# EAGLE design M_G_ext_motor (EAGLE 9.6.2)
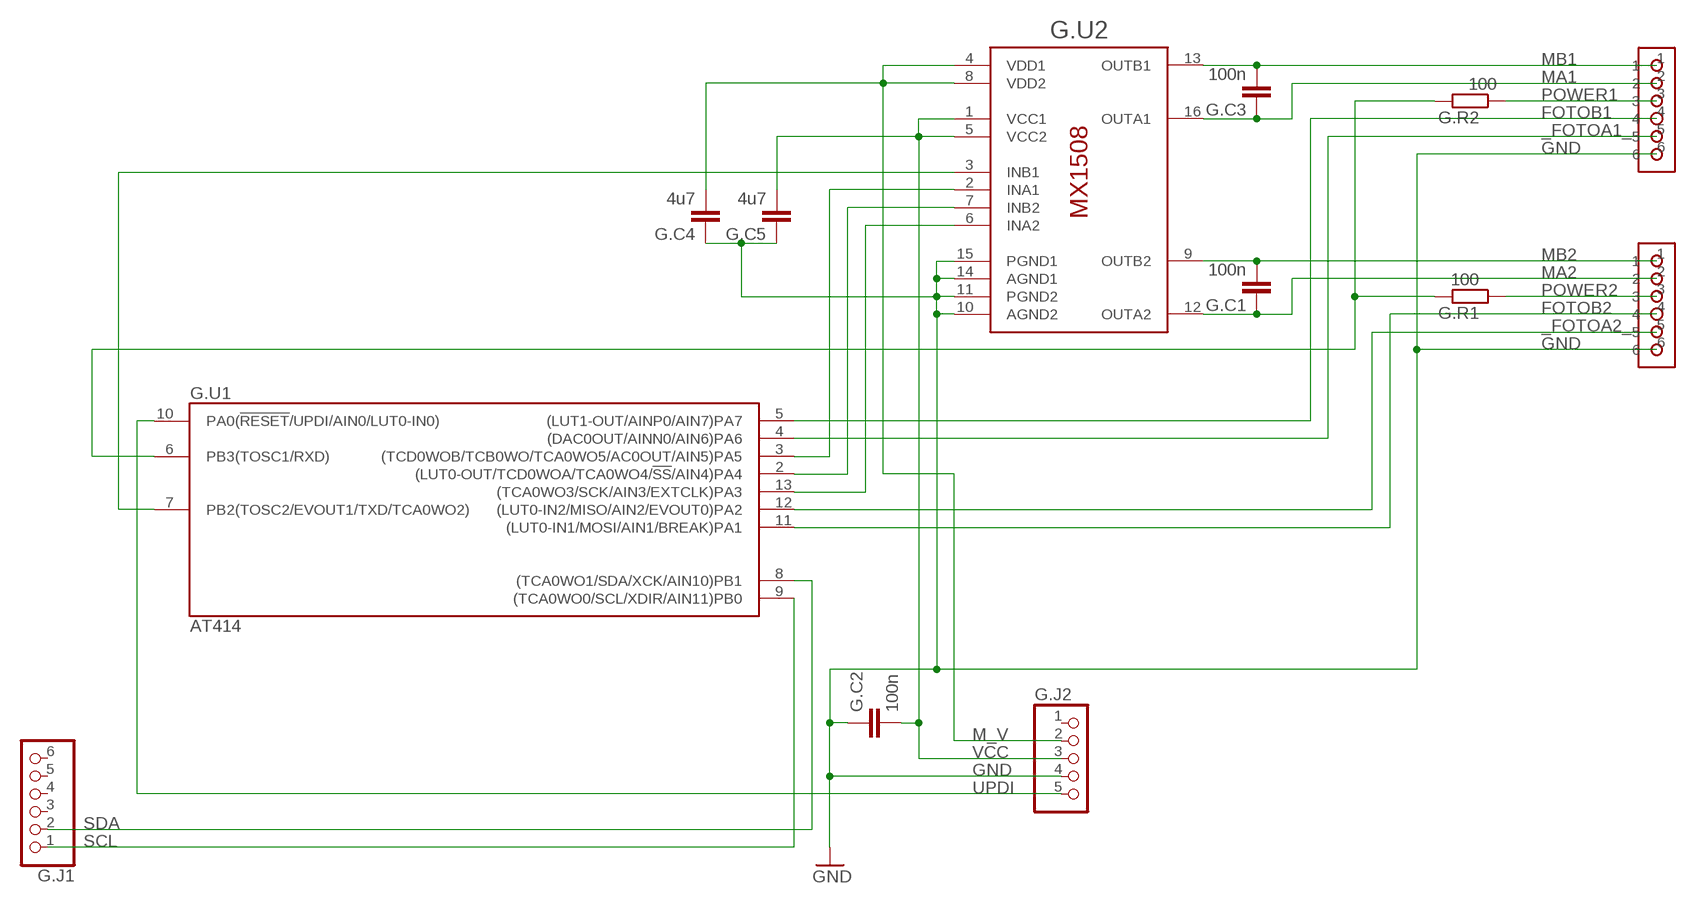
[diagram p0: schematic, sheet 1]

## Parts
G.C1  100n  C-EUC0603  [C0603]
G.C2  100n  C-EUC0603  [C0603]
G.C3  100n  C-EUC0603  [C0603]
G.C4  4u7  C-EUC0603  [C0603]
G.C5  4u7  C-EUC0603  [C0603]
G.J1  PINHD-1X6  [1X06]
G.J2  PINHD-1X5  [1X05]
G.J3  A1250WR-6  [A1250WR-6]
G.MOTO1  A1250WR-6  [A1250WR-6]
G.R1  100  R-EU_R0603  [R0603]
G.R2  100  R-EU_R0603  [R0603]
G.U1  AT414  ATTINY414-SSN  [SO14]
G.U2  MX1508  [SOP16]

## Nets
_FOTOA1_: G.MOTO1.5 G.U1.4((DAC0OUT/AINN0/AIN6)PA6)
_FOTOA2_: G.J3.5 G.U1.12((LUT0-IN2/MISO/AIN2/EVOUT0)PA2)
FOTOB1: G.MOTO1.4 G.U1.5((LUT1-OUT/AINP0/AIN7)PA7)
FOTOB2: G.J3.4 G.U1.11((LUT0-IN1/MOSI/AIN1/BREAK)PA1)
GND: G.C2.1 G.C4.1 G.C5.1 G.J2.4 G.J3.6 G.MOTO1.6 G.U2.10(AGND2) G.U2.11(PGND2) G.U2.14(AGND1) G.U2.15(PGND1)
INA1: G.U1.3((TCD0WOB/TCB0WO/TCA0WO5/AC0OUT/AIN5)PA5) G.U2.2(INA1)
INA2: G.U1.13((TCA0WO3/SCK/AIN3/EXTCLK)PA3) G.U2.6(INA2)
INB1: G.U1.7(PB2(TOSC2/EVOUT1/TXD/TCA0WO2)) G.U2.3(INB1)
INB2: G.U1.2((LUT0-OUT/TCD0WOA/TCA0WO4/!SS!/AIN4)PA4) G.U2.7(INB2)
M_V: G.C4.2 G.J2.2 G.U2.4(VDD1) G.U2.8(VDD2)
MA1: G.C3.1 G.MOTO1.2 G.U2.16(OUTA1)
MA2: G.C1.1 G.J3.2 G.U2.12(OUTA2)
MB1: G.C3.2 G.MOTO1.1 G.U2.13(OUTB1)
MB2: G.C1.2 G.J3.1 G.U2.9(OUTB2)
POWER1: G.MOTO1.3 G.R2.1
POWER2: G.J3.3 G.R1.1
POWER_LED: G.R1.2 G.R2.2 G.U1.6(PB3(TOSC1/RXD))
SCL: G.J1.1 G.U1.9((TCA0WO0/SCL/XDIR/AIN11)PB0)
SDA: G.J1.2 G.U1.8((TCA0WO1/SDA/XCK/AIN10)PB1)
UPDI: G.J2.5 G.U1.10(PA0(!RESET!/UPDI/AIN0/LUT0-IN0))
VCC: G.C2.2 G.C5.2 G.J2.3 G.U2.1(VCC1) G.U2.5(VCC2)
Unconnected: G.J1.3 G.J1.4 G.J1.5 G.J1.6 G.J2.1

## Power pins joined to a net without a drawn wire
GND: G.J3.$1(GND) G.J3.$2(GND) G.MOTO1.$1(GND) G.MOTO1.$2(GND) G.U1.14(GND)
VCC: G.U1.1(VCC)

## Library data of the parts
G.C1-G.C5 = rcl:C-EU: CAPACITOR, European symbol; SPICEPREFIX: C
G.J1 = pinhead2:PINHD-1X6: PIN HEADER
G.J2 = pinhead2:PINHD-1X5: PIN HEADER
G.J3 G.MOTO1 = hugo:A1250WR-6
G.R1 G.R2 = rcl:R-EU_: RESISTOR, European symbol; SPICEPREFIX: R
G.U1 = atmel:ATTINY*14: 8-bit AVR tiny-1-series Microcontroller CPU: two-cycle hardware multiplier single pin Unified Program Debug Interface (UPDI) programmable watchdog timer with separate on-chip oscillator programmable brown-out detection circuit with software disable function internal calibrated oscillator Status aktiv aktiv aktiv aktiv ATtiny214 ATtiny414 ATtiny814 ATtiny1614 General purpose working registers 32 SRAM 128 B 256 B 512 B 2 kB Program flash memory 2 kB 4 kB 8 kB 16 kB EEPROM 64 B 128 B 128 B 256 B 16-bit Timer/Counter type A (TCA) 1 16-bit Timer/Counter type B (TCB) 1 2 12-bit Timer/Counter type D (TCD) 1 Real Time Counter (RTC) 1 USART 1 SPI 1 TWI (I2C) 1 ADC 1 2 ADC channels 10 10+4 ADC resolution 10 bit DAC 1 3 AC 1 3 Peripheral Touch Controller (PTC) - 1 PTC number of self-capacitance channels - 6 PTC number of mutual-capacitance channels - 9 Custom Configurable Logic/Lookup tables 1/2 Window Watchdog 1 Event System channels 6 General purpose I/O 12 External interrupts 12 CRCSCAN 1 Operating voltage 1.8 ... 5.5 V Speed grade 0 ... 5 MHz @ 1.8 ... 5.5 V 0 ... 10 MHz @ 2.7 ... 5.5 V 0 ... 20 MHz @ 4.5 ... 5.5 V Clock options internal 16/20 MHz low power RC oscillator internal 32.768 kHz ultra low power RC oscillator external 32.768 kHz low-frequency crystal oscillator external clock input Pin Name Other/Special ADC0 ADC1 PTC AC0 AC1 AC2 DAC0 USART0 SPI0 TWI0 TCA0 TCBn TCD0 CCL PA0 !RESET, UPDI AIN0 LUT0-IN0 PA1 AIN1 TxD MOSI SDA LUT0-IN1 PA2 EVOUT0 AIN2 RxD MISO SCL LUT0-IN2 PA3 EXTCLK AIN3 XCK SCK WO3 TCB1 WO PA4 AIN4 AIN0 X0/Y0 XDIR !SS WO4 WOA LUT0-OUT PA5 VREFA AIN5 AIN1 X1/Y1 OUT AINN0 WO5 TCB0 WO WOB PA6 AIN6 AIN2 X2/Y2 AINN0 AINP1 AINP0 OUT PA7 AIN7 AIN3 X3/Y3 AINP0 AINP0 AINN0 LUT1-OUT PB3 TOSC1 OUT RxD WO0 PB2 TOSC2, EVOUT1 OUT TxD WO2 PB1 AIN10 X4/Y4 AINP2 XCK SDA WO1 PB0 AIN11 X5/Y5 AINP2 AINP1 XDIR SCL WO0 only available in devices with 8/16KByte flash, X- or Y-line only available in device ATtiny1614
G.U2 = hugo:MX1508

## Board
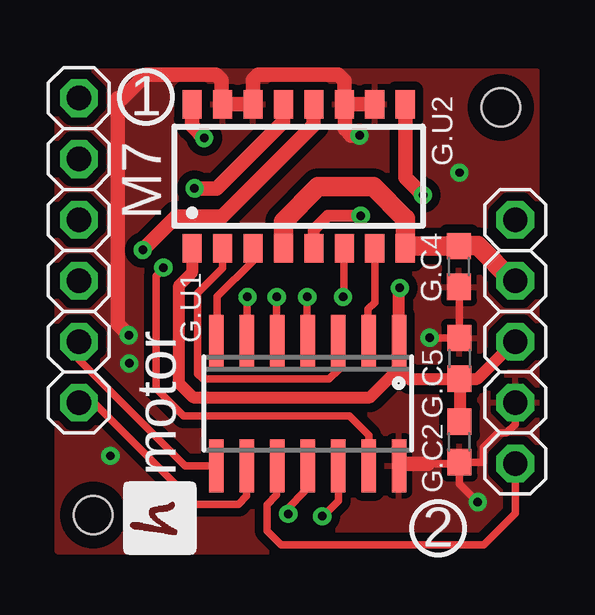
[diagram p1: board, top side]
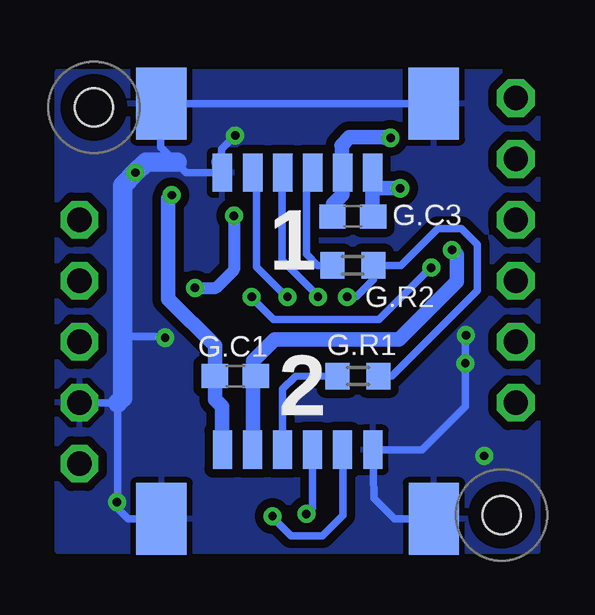
[diagram p2: board, bottom side, seen from below]

No outline drawn. Coordinates in mm, seen from the top.
Copper layers (1*16): Top 0.035mm / dielectric 1.5mm / Bottom 0.035mm
Design rules "default *": minimum track width 12mil, minimum drill 0.35mm, track to track 14mil, track to pad 13mil, pad to pad 10mil, via to via 14mil, smd to smd 14mil, copper to edge 15mil, drill to drill 15mil, minimum pad ring 10mil, minimum via ring 8mil, stop-mask expansion 4mil, vias tented up to drill 0mil, thermal gap 10mil
Holes 1.6 mm at 2,2 19,19
tRestrict: area 18,18 to 20,20; area 1,1 to 3,3
bRestrict: area 1,1 to 3,3; area 18,18 to 20,20

### Footprints (pad centres in the part's own frame; a part is rotated, then mirrored left to right if it is on the bottom)
C0603 = smd 1.1 x 1: 1 -0.85,0; 2 0.85,0
1X06 = drill 1.016 pad 1.575 octagon: 1 -6.35,0; 2 -3.81,0; 3 -1.27,0; 4 1.27,0; 5 3.81,0; 6 6.35,0
1X05 = drill 1.016 pad 1.575 octagon: 1 -5.08,0; 2 -2.54,0; 3 0,0; 4 2.54,0; 5 5.08,0
A1250WR-6 = smd 0.8 x 1.6: 1 -3.128,2.54; 2 -1.878,2.54; 3 -0.628,2.54; 4 0.622,2.54; 5 1.872,2.54; 6 3.142,2.54 | smd 2.1 x 3: $1 -5.678,-0.34; $2 5.682,-0.34
R0603 = smd 1 x 1.1: 1 -0.85,0; 2 0.85,0
SO14 = smd 0.6 x 2.2: 1 -3.81,-2.6; 2 -2.54,-2.6; 3 -1.27,-2.6; 4 0,-2.6; 5 1.27,-2.6; 6 2.54,-2.6; 7 3.81,-2.6; 8 3.81,2.6; 9 2.54,2.6; 10 1.27,2.6; 11 0,2.6; 12 -1.27,2.6; 13 -2.54,2.6; 14 -3.81,2.6
SOP16 = smd 0.8 x 1.2: 1 -4.445,-3; 2 -3.175,-3; 3 -1.905,-3; 4 -0.635,-3; 5 0.635,-3; 6 1.905,-3; 7 3.175,-3; 8 4.445,-3; 9 4.445,3; 10 3.175,3; 11 1.905,3; 12 0.635,3; 13 -0.635,3; 14 -1.905,3; 15 -3.175,3; 16 -4.445,3

### Placement (x,y rotation side)
G.C1  13.1,7.8 180 bottom
G.C2  17.27,5.05 90 top
G.C3  8.2,14.45 0 bottom
G.C4  17.25,12.37 90 top
G.C5  17.27,8.54 270 top
G.J1  1.4,13.04 90 top
G.J2  19.6,9.23 270 top
G.J3  10.5,2.18 0 bottom
G.MOTO1  10.5,18.82 180 bottom
G.R1  7.99,7.8 0 bottom
G.R2  8.2,12.42 0 bottom
G.U1  10.95,6.65 180 top
G.U2  10.57,16.13 0 top

### Tracks (layer width: path | path; a pad name or v marks a point on that pad's centre or on a via)
_FOTOA1_  (via drill 0.35)
  Top 0.305: G.U1.4 10.92,9.28 10.92,11.05 10.96,11.08 v10.92,11.1
  Bottom 0.305: v10.92,11.1 10.97,11.1 12.22,12.35 12.22,16.1 12.37,16.25 G.MOTO1.5
_FOTOA2_  (via drill 0.35)
  Top 0.305: G.U1.12 12.22,2.6 11.57,1.96 v11.55,1.96 11.51,1.92
  Bottom 0.305: G.J3.5 8.61,4.71 8.61,1.98 9.46,1.14 10.78,1.14 11.55,1.9 v11.55,1.96
FOTOB1  (via drill 0.35)
  Top 0.305: G.U1.5 9.65,9.28 v9.65,11.1
  Bottom 0.305: G.MOTO1.4 11.15,16.25 11.15,12.64 9.65,11.14 v9.65,11.1
FOTOB2  (via drill 0.35)
  Top 0.305: G.U1.11 10.82,3.93 10.82,2.99 10.13,2.3 v10.13,2.05
  Bottom 0.305: G.J3.4 9.88,2.3 v10.13,2.05
GND  (via drill 0.35)
  Top 0.305: G.C4.1 17.27,11.51 G.C5.1 16.04,9.39 v16.03,9.4 | 15.96,4.13 17.2,4.13 G.C2.1 | G.C2.1 17.27,3.3 v18.03,2.54 | 19.6,6.3 G.J2.4 19.6,5.79 19.23,5.42 18.87,5.42 18.28,4.83 18.28,4.21 G.C2.1
  Top 0.406: G.C2.1 17.27,3.92 17.18,3.83
  Top 0.61: G.C2.1 17.19,4.21 | 15.96,4.13 14.76,4.13 G.U1.14 | G.U2.11 G.U2.10 | G.U2.11 12.47,20.12 12.22,20.37 8.87,20.37 8.66,20.17 G.U2.14 G.U2.15 7.36,19.16 7.36,20.13 7.13,20.36 4.2,20.36 3.22,19.38 3.02,19.38 3.02,9.96 v3.48,9.5 | G.U2.11 12.5,19.1 12.5,18.09 12.75,17.83 v13.11,17.83
  Bottom 0.305: 15.51,1.84 17.58,1.84 18.03,2.3 v18.03,2.54 18.01,2.56 18.01,6.68 G.J2.4 | 15.58,16.71 15.58,16.79 15.52,16.73 | 15.58,16.71 16.21,17.35 16.21,19.16 5.49,19.16 | v3.48,9.5 3.5,9.48 v3.5,8.33 3.5,6.53 5.32,4.72 G.J3.6 7.33,2.71 6.46,1.84 4.79,1.84 | v13.11,17.83 13.68,17.26 G.MOTO1.6 15.15,16.28 15.58,16.71 | v16.03,9.4 16.08,9.45 17.8,9.45
  Bottom 0.61: v3.48,9.5 v3.49,9.5
  Bottom 0.813: 15.52,16.73 16.83,16.73 v17.27,16.28 17.8,15.75 17.8,9.45 17.8,6.88 18.01,6.68 | 13.7,16.71 13.68,16.69 G.MOTO1.6
  other vias: 2.72,4.47
  pour Top (isolate 0.254): 0.5,20.5 0.5,0.5 20.5,0.5 20.5,20.5
  pour Bottom (isolate 0.254): 0.5,20.5 0.5,0.5 20.5,0.5 20.5,20.5
INA1
  Top 0.305: G.U1.3 12.22,8.05 11.84,7.67 6.58,7.67 6.36,7.89 6.36,11.25 7.4,12.3 G.U2.2
INA2  (via drill 0.35)
  Top 0.305: G.U1.13 13.51,4.08 13.51,5.31 12.68,6.15 5.77,6.15 4.63,7.29 4.63,11.98 v4.93,12.32 | G.U2.6 12.45,13.1 12.45,11.2 v12.42,11.1
  Bottom 0.305: v12.42,11.1 12.42,11.08 11.5,10.16 7.1,10.16 v4.94,12.33 v4.93,12.32
INB1
  Top 0.305: G.U2.3 8.65,12.6 7.16,11.11 7.16,9.28 G.U1.7
INB2
  Top 0.305: 13.95,12.93 G.U2.7 13.74,10.87 13.46,10.59 13.46,9.28 G.U1.2
M_V
  Top 0.305: 15.01,14.37
  Top 0.813: G.U2.8 15.01,13.28 15.07,13.22 G.C4.2 17.27,13.24 18.03,13.24 19.5,11.77 G.J2.2 | 15.01,14.37 13.68,15.7 11.38,15.7 9.93,14.25 G.U2.4 | G.U2.8 15.01,13.23 | 15.01,14.37 G.U2.8
MA1  (via drill 0.35)
  Top 0.61: G.U2.16 6.12,18.24 v6.63,17.73
  Bottom 0.61: v6.63,17.73 6.82,17.73 6.85,17.75 8.33,17.75 8.67,17.41 8.65,17.39 G.MOTO1.2 8.62,15.37 9.02,14.97 G.C3.1
MA2  (via drill 0.35)
  Top 0.61: v4.06,13.06 5.46,14.45 7.38,14.45 11.2,18.27 G.U2.12
  Bottom 0.61: v4.06,13.06 3.87,12.86 3.87,11.74 6.29,9.32 11.47,9.32 12.36,8.43 G.C1.1 12.36,7.62 12.36,4.73 G.J3.2
MB1  (via drill 0.35)
  Top 0.61: v6.22,15.62 7.15,15.62 9.93,18.39 G.U2.13
  Bottom 0.61: 7.36,15.59 7.41,15.61 G.MOTO1.1 | v6.22,15.62 6.25,15.65 7.36,15.65 G.MOTO1.1 | G.MOTO1.1 7.37,14.39 G.C3.2
MB2  (via drill 0.35)
  Top 0.61: v15.75,15.35 v15.74,15.34 15.01,16.07 G.U2.9
  Bottom 0.61: v15.75,15.35 15.89,15.2 15.89,11.02 13.95,9.07 G.C1.2 13.95,6.83 13.65,6.53 13.65,4.78 G.J3.1
POWER1
  Bottom 0.305: G.MOTO1.3 10.13,16.03 10.13,12.88 9.67,12.42 G.R2.1
POWER2
  Bottom 0.305: G.J3.3 11.13,7.25 10.59,7.79 G.R1.1 | G.R1.1
POWER_LED  (via drill 0.35)
  Top 0.305: G.U1.6 8.41,11.1 v8.43,11.1
  Bottom 0.305: v8.43,11.1 | v8.43,11.1 8.05,11.11 7.33,11.82 G.R2.2 6.19,12.42 4.66,13.95 3.66,13.95 3,13.28 3,11.37 6.57,7.8 7.13,7.81 G.R1.2 | 8.43,11.2 v8.43,11.1 | v8.43,11.1 8.39,11.14
SCL
  Top 0.305: G.U1.9 8.4,2.79 8.05,2.45 6.26,2.45 2.05,6.66 G.J1.1
SDA
  Top 0.305: G.U1.8 5.84,4.05 1.4,8.49 G.J1.2
UPDI
  Top 0.305: 9.6,3.98 G.U1.10 9.65,4.03 9.65,2.85 9.25,2.44 9.25,1.35 9.83,0.77 18.29,0.77 19.6,2.07 G.J2.5
VCC  (via drill 0.35)
  Top 0.305: 17.3,5.9 17.27,5.93
  Top 0.508: 6.28,12.97 G.U2.1 6.12,12.11 5.59,11.58 5.59,7.49 6.17,6.91 13.55,6.91 14.76,8.12 | G.U1.1 14.73,9.28 14.73,11.43 v14.78,11.47 | G.U2.5 11.21,13.91 11.78,14.49 v13.16,14.49 | G.U1.1 14.76,8.27 | G.U1.1 14.76,8.12 | 14.76,8.12 15.22,7.66 17.3,7.66 17.3,7.65 | 17.24,5.94 G.C2.2 17.27,5.93 | 17.3,7.65 G.C5.2 18.01,7.69 19.55,9.23 G.J2.3 | 17.3,7.65 17.3,5.9
  Bottom 0.508: v13.16,14.49 13.16,12.23 13.91,11.47 v14.78,11.47

### Text on the board
tPlace: 1 | M7 | motor | 2
bNames: 1 | 2